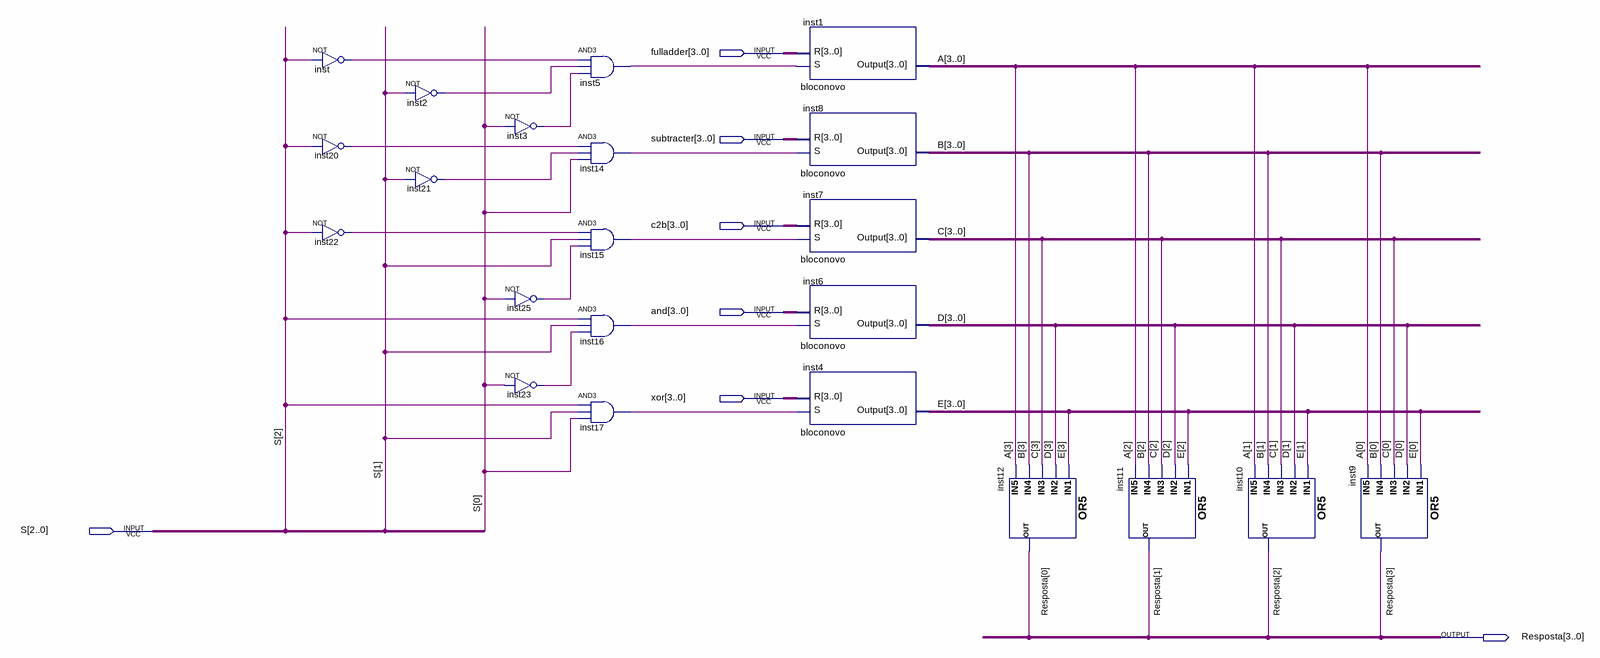
[diagram p0: schematic sheet]
// Quartus schematic mux5incompleto.bdf as structural Verilog: 22 symbols, 7 pins
module mux5incompleto (
  input  [3:0] fulladder,
  input  [3:0] subtracter,
  input  [3:0] c2b,
  input  [3:0] \and ,
  input  [3:0] \xor ,
  input  [2:0] S,
  output [3:0] Resposta
);

  wire inst2_out, inst3_out, inst5_out, inst14_out, inst15_out, inst16_out, inst17_out, inst20_out,
       inst21_out, inst22_out, inst23_out, inst25_out, inst_out;
  wire [3:0] A, B, C, D, E;

  not inst (inst_out, S[2]);
  not inst20 (inst20_out, S[2]);
  not inst22 (inst22_out, S[2]);
  not inst2 (inst2_out, S[1]);
  not inst21 (inst21_out, S[1]);
  not inst3 (inst3_out, S[0]);
  not inst25 (inst25_out, S[0]);
  not inst23 (inst23_out, S[0]);
  and inst5 (inst5_out, inst_out, inst2_out, inst3_out);
  and inst14 (inst14_out, inst20_out, inst21_out, S[0]);
  and inst15 (inst15_out, inst22_out, S[1], inst25_out);
  and inst16 (inst16_out, S[2], S[1], inst23_out);
  and inst17 (inst17_out, S[2], S[1], S[0]);
  bloconovo inst1 (.S(inst5_out), .R(fulladder), .Output(A));
  bloconovo inst8 (.S(inst14_out), .R(subtracter), .Output(B));
  bloconovo inst7 (.S(inst15_out), .R(c2b), .Output(C));
  bloconovo inst6 (.S(inst16_out), .R(\and ), .Output(D));
  bloconovo inst4 (.S(inst17_out), .R(\xor ), .Output(E));
  or inst12 (Resposta[0], E[3], D[3], C[3], B[3], A[3]);
  or inst11 (Resposta[1], E[2], D[2], C[2], B[2], A[2]);
  or inst10 (Resposta[2], E[1], D[1], C[1], B[1], A[1]);
  or inst9 (Resposta[3], E[0], D[0], C[0], B[0], A[0]);
endmodule
